# EAGLE design OszillatorFix (EAGLE 6.1)
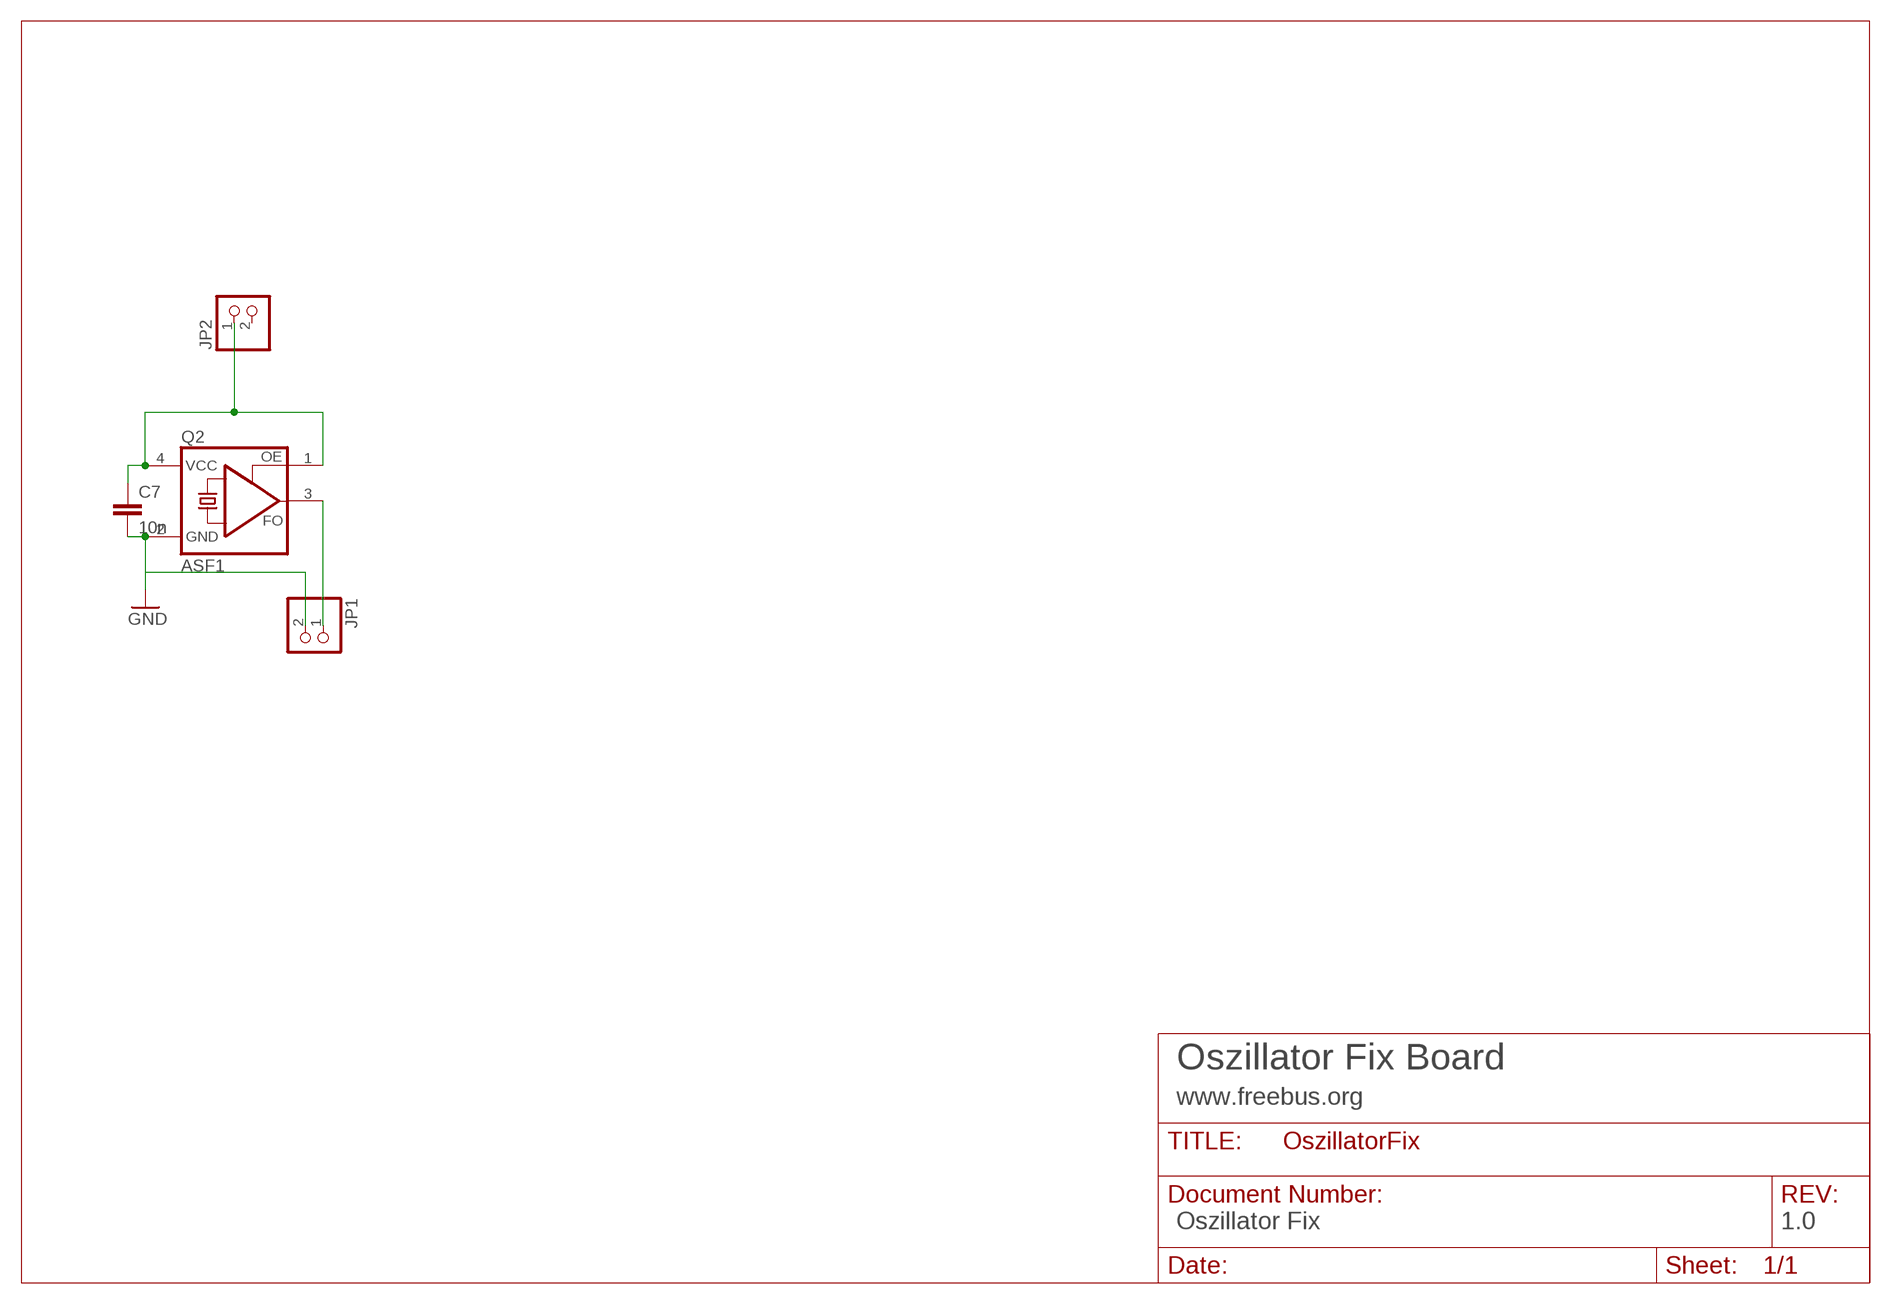
[diagram p0: schematic, sheet 1]

## Parts
C7  10n  C-EUC1206  [C1206]
JP1  PINHD-1X2  [1X02]
JP2  PINHD-1X2  [1X02]
Q2  ASF1  [ASF]

## Nets
GND2: C7.2 JP1.2 Q2.2(GND) ; supply symbol labelled GND
N$3: JP1.1 Q2.3(FO)
VCC: C7.1 JP2.1 Q2.1(OE) Q2.4(VCC)
Unconnected: JP2.2

## Notes on the sheet
- Oszillator Fix Board
- www.freebus.org
- Oszillator Fix | 1.0

## Library data of the parts
C7 = rcl:C-EU: CAPACITOR, European symbol
JP1 JP2 = pinhead:PINHD-1X2: PIN HEADER
Q2 = crystal:ASF*: CRYSTAL CLOCK OSCILLATORS 5.0 Vdc or 3.3 Vdc - LOW PROFILE ULTRA MINIATURE CERAMIC SURFACE MOUNT Source: http://www.abracon.com/Oscillators/asf1-L-L1.pdf

## Board
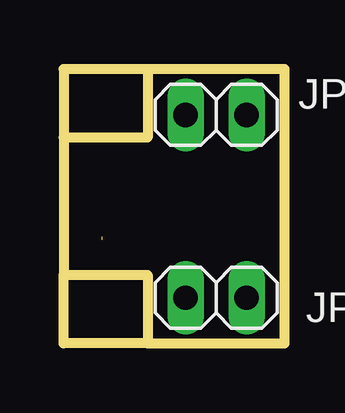
[diagram p1: board, top side]
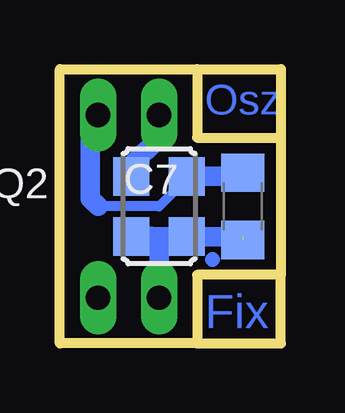
[diagram p2: board, bottom side, seen from below]

Size 9.21 x 11.43 mm. Coordinates in mm from the lower left corner, seen from the top.
Outline: 0,2.86 3.49,2.86 3.49,0
Outline: 3.49,0 9.21,0 9.21,11.43 3.49,11.43
Outline: 3.49,11.43 3.49,8.57 0,8.57
Outline: 0,8.57 0,2.86
Outline: 3.49,11.43 0,11.43 0,8.57
Outline: 3.49,0 0,0 0,2.86
Copper layers (1*16): Top 0.035mm / dielectric 1.5mm / Bottom 0.035mm
Design rules: minimum track width 16mil, minimum drill 24mil, track to track 20mil, track to pad 10mil, pad to pad 10mil, via to via 10mil, smd to smd 10mil, copper to edge 4mil, drill to drill 8mil, minimum pad ring 10mil, minimum via ring 8mil, stop-mask expansion 4mil, vias tented up to drill 0mil, thermal gap 10mil

### Footprints (pad centres in the part's own frame; a part is rotated, then mirrored left to right if it is on the bottom)
C1206 = smd 1.6 x 1.8: 1 -1.4,0; 2 1.4,0
1X02 = drill 1.016 long: 1 -1.27,0; 2 1.27,0
ASF = smd 1.6 x 1.5: 1 -1.25,-1.15; 2 1.25,-1.15; 3 1.25,1.15; 4 -1.25,1.15

### Placement (x,y rotation side)
C7  1.59,5.71 90 bottom
JP1  6.35,9.53 0 top
JP2  6.35,1.91 0 top
Q2  5.08,5.71 90 bottom

### Tracks (layer width: path | path; a pad name or v marks a point on that pad's centre or on a via)
GND2
  Bottom 0.406: JP1.2 7.62,8.7 | Q2.2 4.25,6.55 5.08,5.72 7.62,5.72 | 1.74,6.96 C7.2
  Bottom 0.813: 7.62,5.72 7.94,6.03 7.94,9.21 JP1.2 | Q2.2 1.74,6.96
N$3
  Bottom 0.61: Q2.3 6.23,7.42
  Bottom 0.813: 6.23,7.42 5.08,8.57 JP1.1
VCC  (1 unrouted)
  Bottom 0.406: 5.08,4.47 5.08,4.45 5.08,4.13 | Q2.4 6.33,4.47
  Bottom 0.61: Q2.1 5.08,4.47 Q2.4 | 5.42,4.47 5.08,4.13
  Bottom 0.813: 6.33,4.47 6.35,4.45 5.08,4.45 1.59,4.45 | Q2.4 5.42,4.47 | 5.08,4.13 JP2.1
(copper drawn outside any net)
  shapes: Bottom circle x1

### Text on the board
Bottom: Osz | Fix